# EAGLE schematic ECG (EAGLE 9.5.2)
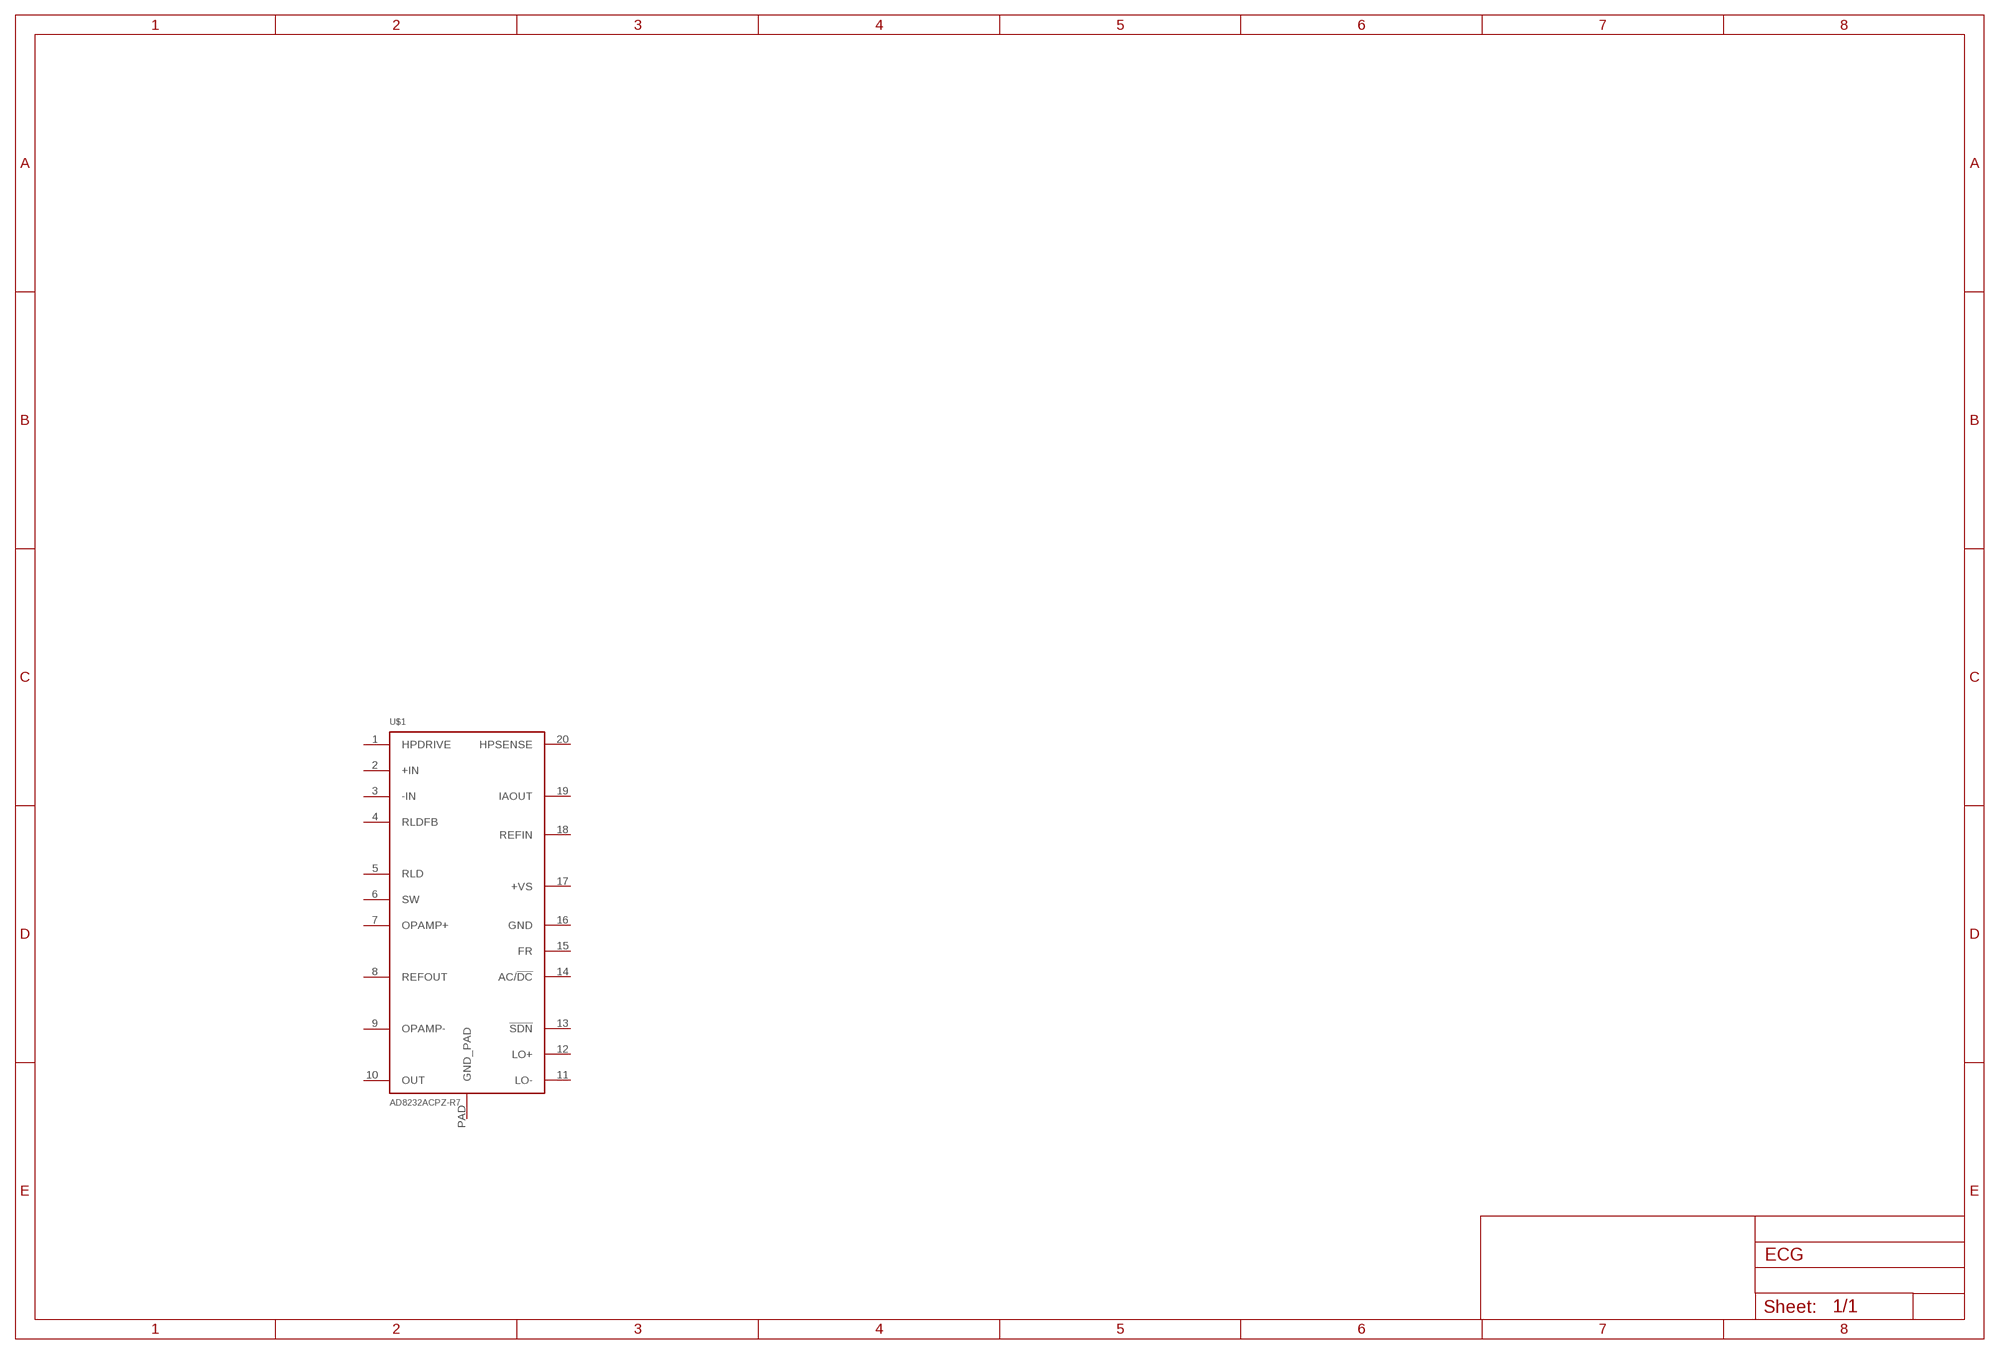
[diagram p0: schematic, sheet 1]

## Parts
U$1  AD8232ACPZ-R7  AD8232  [LFCSP_20]
Unconnected: U$1.1(HPDRIVE) U$1.2(+IN) U$1.3(-IN) U$1.4(RLDFB) U$1.5(RLD) U$1.6(SW) U$1.7(OPAMP+) U$1.8(REFOUT) U$1.9(OPAMP-) U$1.10(OUT) U$1.11(LO-) U$1.12(LO+) U$1.13(!SDN) U$1.14(AC/!DC) U$1.15(FR) U$1.16(GND) U$1.17(+VS) U$1.18(REFIN) U$1.19(IAOUT) U$1.20(HPSENSE) U$1.PAD(GND_PAD)

## Library data of the parts
U$1 = SparkFun-Sensors:AD8232: AD8232 Single Lead Heart Rate Monitor IC Datasheet <https://cdn.sparkfun.com/datasheets/Sensors/Biometric/AD8232.pdf> SparkFun Products SparkFun Single Lead Heart Rate Monitor - AD8232 <https://www.sparkfun.com/products/12650> (SEN-12650); PROD_ID: IC-11886